# Altium schematic sheet FanControl.SchDoc
size A; DocumentNumber: 3; SheetNumber: 3; SheetTotal: 4
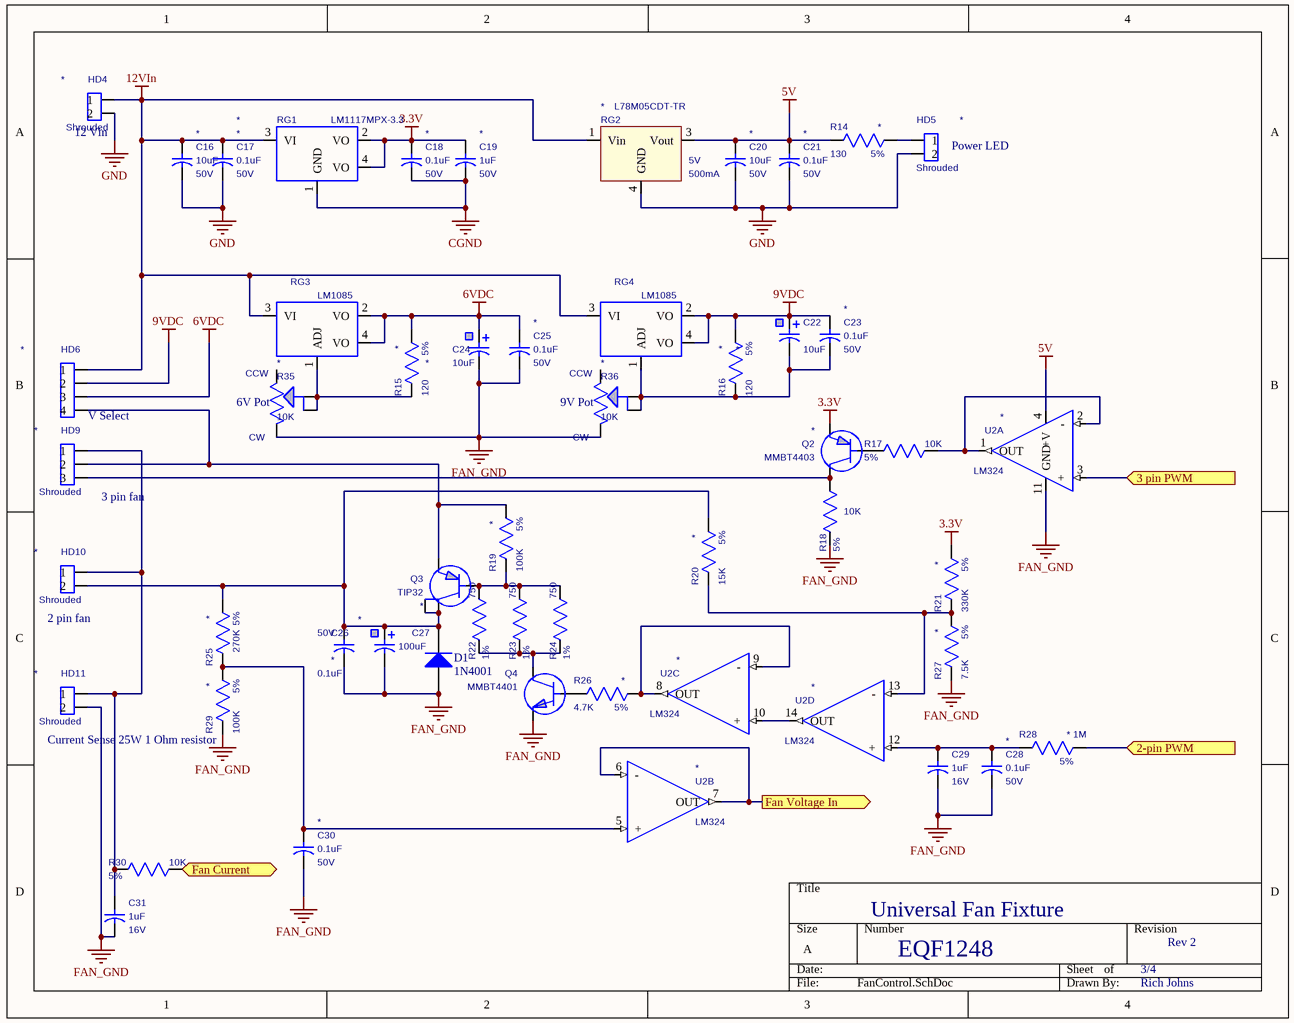
[diagram p0: FanControl.SchDoc]

## Parts
C16  value 10uF  Voltage: 50V  [1206]  (hidden comment: CAP_NON_POLAR_SMT)
C17  value 0.1uF  Voltage: 50V  [0603]  (hidden comment: CAP_NON_POLAR_SMT)
C18  value 0.1uF  Voltage: 50V  [0603]  (hidden comment: CAP_NON_POLAR_SMT)
C19  value 1uF  Voltage: 50V  [1812]  (hidden comment: CAP_NON_POLAR_SMT)
C20  value 10uF  Voltage: 50V  [1206]  (hidden comment: CAP_NON_POLAR_SMT)
C21  value 0.1uF  Voltage: 50V  [0603]  (hidden comment: CAP_NON_POLAR_SMT)
C22  value 10uF  [EIA3216-18]  (hidden comment: 10UF_TANT_16V)
C23  value 0.1uF  Voltage: 50V  [0603]  (hidden comment: CAP_NON_POLAR_SMT)
C24  value 10uF  [EIA3216-18]  (hidden comment: 10UF_TANT_16V)
C25  value 0.1uF  Voltage: 50V  [0603]  (hidden comment: CAP_NON_POLAR_SMT)
C26  value 100uF  [CAP_100RP42]  (hidden comment: 100UF_RP_35V_100)
C27  value 0.1uF  Voltage: 50V  [0603]  (hidden comment: CAP_NON_POLAR_SMT)
C28  value 0.1uF  Voltage: 50V  [0603]  (hidden comment: CAP_NON_POLAR_SMT)
C29  value 1uF  Voltage: 16V  [0603]  (hidden comment: 1.0uF_0603_16V)
C30  value 0.1uF  Voltage: 50V  [0603]  (hidden comment: CAP_NON_POLAR_SMT)
C31  value 1uF  Voltage: 16V  [0603]  (hidden comment: 1.0uF_0603_16V)
D1  1N4001  [DSO-C2/X3.3]
HD4  HeaderType: Shrouded  [HDR2PIN100SHRD]  (hidden comment: HDR2PIN100SHRD)
HD5  HeaderType: Shrouded  [HDR2PIN100SHRD]  (hidden comment: HDR2PIN100SHRD)
HD6  HDR4PIN100SHRD  [HDR4PIN100SHRD]  (value not drawn)
HD9  HeaderType: Shrouded  [HDR3PIN100SHRD]  (hidden comment: HDR3PIN100SHRD)
HD10  HeaderType: Shrouded  [HDR2PIN100SHRD]  (hidden comment: HDR2PIN100SHRD)
HD11  HeaderType: Shrouded  [HDR2PIN100SHRD]  (hidden comment: HDR2PIN100SHRD)
Q2  value MMBT4403  [SOT23-3]  (hidden comment: PNP_TRANSISTOR)
Q3  TIP32  [TO-220-NORMAL]
Q4  value MMBT4401  [SOT23-3]  (hidden comment: 2N4401_SOT23)
R14  value 130  Tolerance: 5%  [RC0603REFLOW-IPC]  (hidden comment: R0603REFLOW_5%)
R15  value 120  Tolerance: 5%  [RC0603REFLOW-IPC]  (hidden comment: R0603REFLOW_5%)
R16  value 120  Tolerance: 5%  [RC0603REFLOW-IPC]  (hidden comment: R0603REFLOW_5%)
R17  value 10K  Tolerance: 5%  [0603]  (hidden comment: Resistor_0603_5%)
R18  value 10K  Tolerance: 5%  [0603]  (hidden comment: Resistor_0603_5%)
R19  value 100K  Tolerance: 5%  [RC0603REFLOW-IPC]  (hidden comment: R0603REFLOW_5%)
R20  value 15K  Tolerance: 5%  [RC0603REFLOW-IPC]  (hidden comment: R0603REFLOW_5%)
R21  value 330K  Tolerance: 5%  [RC0603REFLOW-IPC]  (hidden comment: R0603REFLOW_5%)
R22  value 750  Tolerance: 1%  [0603]  (hidden comment: Resistor_0603_1%)
R23  value 750  Tolerance: 1%  [0603]  (hidden comment: Resistor_0603_1%)
R24  value 750  Tolerance: 1%  [0603]  (hidden comment: Resistor_0603_1%)
R25  value 270K  Tolerance: 5%  [RC0603REFLOW-IPC]  (hidden comment: R0603REFLOW_5%)
R26  value 4.7K  Tolerance: 5%  [RC0603REFLOW-IPC]  (hidden comment: R0603REFLOW_5%)
R27  value 7.5K  Tolerance: 5%  [RC0603REFLOW-IPC]  (hidden comment: R0603REFLOW_5%)
R28  value 1M  Tolerance: 5%  [RC0603REFLOW-IPC]  (hidden comment: R0603REFLOW_5%)
R29  value 100K  Tolerance: 5%  [RC0603REFLOW-IPC]  (hidden comment: R0603REFLOW_5%)
R30  value 10K  Tolerance: 5%  [0603]  (hidden comment: Resistor_0603_5%)
R35  value 10K  [6MM POT]  (hidden comment: POT 6MM 10K)
R36  value 10K  [6MM POT]  (hidden comment: POT 6MM 10K)
RG1  value LM1117MPX-3.3  [SOT-223]  (hidden comment: LM1117SPX-3.3_SOT223)
RG2  value L78M05CDT-TR  Voltage: 5V  Amperage: 500mA  [DPAK]  (hidden comment: REGULATOR_DPAK)
RG3  value LM1085  [TO-220-NORMAL]  (hidden comment: LM1085_TO220)
RG4  value LM1085  [TO-220-NORMAL]  (hidden comment: LM1085_TO220)
U2  value LM324  [SOIC14REFLOW-IPC]  (hidden comment: LM324_SOIC14)  (parts A,B,C,D of 4)

## Ports
2-pin PWM (in), 3 pin PWM (in), Fan Current (out), Fan Voltage In (out)

## Nets
3.3V: C18.1(pin1) C19.1(pin1) Q2.2(emitter) R21.1(pin1) RG1.2(VO) RG1.4(VO)
5V: C20.1(pin1) C21.1(pin1) R14.2(pin2) RG2.3(Vout) U2.4(+V)
6VDC: C24.1(+) C25.1(pin1) HD6.3 R15.1(pin1) RG3.2(VO) RG3.4(VO)
9VDC: C22.1(+) C23.1(pin1) HD6.2 R16.1(pin1) RG4.2(VO) RG4.4(VO)
12VIn: C16.1(pin1) C17.1(pin1) HD4.1 HD6.1 RG1.3(VI) RG2.1(Vin) RG3.3(VI) RG4.3(VI)
CGND: C18.2(pin2) C19.2(pin2) RG1.1(GND)
FAN_GND: C24.2(-) C25.2(pin2) C26.2(pin2) C27.2(pin2) C28.2(pin2) C29.2(pin2) C30.2(pin2) C31.2(pin2) D1.1(A) HD11.2 Q4.2(emitter) R18.2(pin2) R27.2(pin2) R29.2(pin2) R35.4 R36.4 U2.11(GND)
GND: C16.2(pin2) C17.2(pin2) C20.2(pin2) C21.2(pin2) HD4.2 HD5.2 RG2.4(GND)
2-pin PWM: R28.1(pin1) ; port 2-pin PWM
3 pin PWM: U2.3(+) ; port 3 pin PWM
Fan Current: R30.1(pin1) ; port Fan Current
Fan Voltage In: U2.6(-) U2.7(OUT) ; port Fan Voltage In
NetC22_2: C22.2(-) C23.2(pin2) R16.2(pin2) R36.2 R36.3 RG4.1(ADJ)
NetC26_1: C26.1(pin1) C27.1(pin1) D1.2(K) HD10.2 Q3.2(C) Q3.4(C) R20.1(pin1) R25.1(pin1)
NetC28_1: C28.1(pin1) C29.1(pin1) R28.2(pin2) U2.12(+)
NetC30_1: C30.1(pin1) R25.2(pin2) R29.1(pin1) U2.5(+)
NetC31_1: C31.1(pin1) HD9.1 HD10.1 HD11.1 R30.2(pin2)
NetHD5_1: HD5.1 R14.1(pin1)
NetHD6_4: HD6.4 HD9.2 Q3.3(E) R19.1(pin1)
NetHD9_3: HD9.3 Q2.3(collector) R18.1(pin1)
NetQ2_1: Q2.1(base) R17.2(pin2)
NetQ3_1: Q3.1(B) R19.2(pin2) R22.1(pin1) R23.1(pin1) R24.1(pin1)
NetQ4_1: Q4.1(base) R26.2(pin2)
NetQ4_3: Q4.3(collector) R22.2(pin2) R23.2(pin2) R24.2(pin2)
NetR15_2: R15.2(pin2) R35.2 R35.3 RG3.1(ADJ)
NetR17_1: R17.1(pin1) U2.1(OUT) U2.2(-)
NetR20_2: R20.2(pin2) R21.2(pin2) R27.1(pin1) U2.13(-)
NetR26_1: R26.1(pin1) U2.8(OUT) U2.9(-)
NetU2_10: U2.10(+) U2.14(OUT)

Not connected (* = marked no-connect by the designer): HD4 3; HD5 3; HD6 5; HD9 4; HD10 3; HD11 3; R35 1; R36 1; RG2 2(GND)

## Notes on the sheet
- (near HD4) 12 Vin
- (near HD5) Power LED
- (near HD6) V Select
- (near R35) 6V Pot
- (near R36) 9V Pot
- (near HD9) 3 pin fan
- (near HD10) 2 pin fan
- (near R29) Current Sense 25W 1 Ohm resistor
- Universal Fan Fixture
- EQF1248
- 3/4
- Rev 2
- Rich Johns
- (in symbol 6440) CCW; CW

## Library data of the parts
C16 C20 = 265299: Capacitor, 10uF, 50V, Ceramic, X5R, +/- 20%, Non-Polar, 1206, Taiyo Yuden: UMK316BBJ106ML-T or equivalent; plIDX: 265299; Tolerance: +/- 20%; CheckedBy: Sam Rhoufiry; DNS: *; ComponentType: Capacitor; CreatedBy: Mike Tyger; LastUpdatedBy: Mike Tyger; Cost: 0.05; Composition: Ceramic; CapType: X5R; Polarity: Non-Polar; Package: 1206; Vendor: Taiyo Yuden: UMK316BBJ106ML-T or equivalent; ComponentLink1URL: http://www.yuden.co.jp/productdata/catalog/en/mlcc01_e.pdf; ComponentLink1Description: Datasheet; ComponentLink4URL: https://pdm.iconfitness.com/PDM/EBOM/PartsMaintenance/PartsMaintenance.aspx?Editplidx=265299; ComponentLink4Description: PDM Parts Maintenance
C17 C18 C21 C23 C25 C27 C28 C30 = 264790: Capacitor, 0.1uF, 50V, Ceramic, X7R, +/- 20%, Non-Polar, 0603, Kemet: C0603C104M5RACTU or equivalent; plIDX: 264790; Tolerance: +/- 20%; CheckedBy: Sam Rhoufiry; DNS: *; ComponentType: Capacitor; CreatedBy: Mike Tyger; LastUpdatedBy: Mike Tyger; Cost: 0.01; Composition: Ceramic; CapType: X7R; Polarity: Non-Polar; Package: 0603; Vendor: Kemet: C0603C104M5RACTU or equivalent; ComponentLink4URL: https://pdm.iconfitness.com/PDM/EBOM/PartsMaintenance/PartsMaintenance.aspx?Editplidx=264790; ComponentLink4Description: PDM Parts Maintenance
C19 = 265012: Capacitor, 1uF, 50V, Ceramic, Z5U, +/- 20%, Non-Polar, 1812, Kemet: C1812C105M5UACTU or equivalent; plIDX: 265012; Tolerance: +/- 20%; CheckedBy: Sam Rhoufiry; DNS: *; ComponentType: Capacitor; CreatedBy: Mike Tyger; LastUpdatedBy: Mike Tyger; Cost: 0; Composition: Ceramic; CapType: Z5U; Polarity: Non-Polar; Package: 1812; Vendor: Kemet: C1812C105M5UACTU or equivalent; ComponentLink4URL: https://pdm.iconfitness.com/PDM/EBOM/PartsMaintenance/PartsMaintenance.aspx?Editplidx=265012; ComponentLink4Description: PDM Parts Maintenance
C22 C24 = 10669: Capacitor, 10uF, 16V, Tantalum, General Purpose, +/- 20%, Polar, EIA 3216-18, KEMET: T491A106M016AS or Exact Equivalent; Tolerance: +/- 20%; plIDX: 10669; Voltage: 16V; Composition: Tantalum; Package: EIA 3216-18; CapType: General Purpose; Polarity: Polar; Vendor: KEMET: T491A106M016AS or Exact Equivalent; CheckedBy: B. Lyon; Datasheet: G:\accel_lib\datasheets\T491-Kemet.pdf; ModifyDate: 01/05/2007 12:29:47; HelpURL: G:\accel_lib\datasheets\T491-Kemet.pdf; ComponentType: Capacitor; DNS: *; Cost: 0.051; ComponentLink4URL: https://pdm.iconfitness.com/PDM/EBOM/PartsMaintenance/PartsMaintenance.aspx?Editplidx=10669; ComponentLink4Description: PDM Parts Maintenance
C26 = 3428: Capacitor, 100uF, 35V, Electrolytic, +/- 20%, Radial, Polar, 0.1 in., Nichicon: UVR1V101MED or Equivalent; LeadSpacing: 0.1 in.; Tolerance: +/- 20%; PackageOutlineLayer: PackageOutline; IDF_COMP: 1; plIDX: 3428; DNS: *; Voltage: 35V; Composition: Electrolytic; Leads: Radial; Polarity: Polar; Vendor: Nichicon: UVR1V101MED or Equivalent; CheckedBy: A. Tyger; ModifyDate: 04/06/2006 14:59:49; Datasheet: G:\accel_lib\datasheets\Nichicon-VRSerisAlumElecRadialCap.pdf; ComponentHeight: 475mil; HelpURL: G:\accel_lib\datasheets\Nichicon-VRSerisAlumElecRadialCap.pdf; ComponentType: Capacitor; Cost: 0.05; ComponentLink4URL: https://pdm.iconfitness.com/PDM/EBOM/PartsMaintenance/PartsMaintenance.aspx?Editplidx=3428; ComponentLink4Description: PDM Parts Maintenance
C29 C31 = 18838: Capacitor, 1uF, 16V, Ceramic, X5R, +/- 10%, Non-Polar, 0603, 2, MURATA: GRM188R61C105KA93D OR EQUIVALENT; Tolerance: +/- 10%; plIDX: 18838; Composition: Ceramic; Package: 0603; CapType: X5R; Polarity: Non-Polar; Vendor: MURATA: GRM188R61C105KA93D OR EQUIVALENT; CheckedBy: gdeguzman; ModifyDate: 3/9/10; ComponentType: Capacitor; Supplier 1: Digi-Key; Supplier Part Number 1: 490-1536-2-ND; LastUpdatedBy: Rui Zhang; Cost: 0.001; Pins: 2; ComponentLink4URL: https://pdm.iconfitness.com/PDM/EBOM/PartsMaintenance/PartsMaintenance.aspx?Editplidx=18838; ComponentLink4Description: PDM Parts Maintenance
D1 = Diode: Default Diode; Published: 8-Jun-2000; LatestRevisionDate: 17-Jul-2002; LatestRevisionNote: Re-released for DXP Platform.; PackageVersion: Sep-1996; PackageReference: SMC; Publisher: Altium Limited; Code_JEDEC: DO-214-AB
HD4 HD5 HD10 HD11 = 1766: Header, 0.100 in., 2 Pins, Shrouded, AMP: 644486-2; PackageOutlineLayer: PackageOutline; IDF_COMP: 1; plIDX: 1766; LeadSpacing: 0.100 in.; Pins: 2; Vendor: AMP: 644486-2; CheckedBy: *; Datasheet: g:\accel_lib\datasheets\MTA-AMP.pdf; ModifyDate: 07/30/2008 17:40:27; ComponentHeight: 625mil; ComponentType: Header; DNS: *; LastUpdatedBy: Mike Tyger; Cost: 0.042; ComponentLink4URL: https://pdm.iconfitness.com/PDM/EBOM/PartsMaintenance/PartsMaintenance.aspx?Editplidx=1766; ComponentLink4Description: PDM Parts Maintenance
HD6 = 1768: Header, 0.100 in., 4 pin Pins, Shrouded, AMP: 644486-4; IDF_COMP: 1; Reference: g:\accel_lib\datasheets\MTA-AMP.pdf; plIDX: 1768; LeadSpacing: 0.100 in.; Pins: 4 pin; HeaderType: Shrouded; Vendor: AMP: 644486-4; CheckedBy: Michael Angeli; Datasheet: G:\accel_lib\datasheets\644486-AMP-header.pdf; ComponentHeight: 625mil; ModifyDate: 07/30/2008 17:40:28; ComponentType: Header; DNS: *; Cost: 0.07; ComponentLink4URL: https://pdm.iconfitness.com/PDM/EBOM/PartsMaintenance/PartsMaintenance.aspx?Editplidx=1768; ComponentLink4Description: PDM Parts Maintenance
HD9 = 1767: Header, 0.100 in., 3 pin Pins, Shrouded, AMP: 644486-3; PackageOutlineLayer: PackageOutline; IDF_COMP: 1; plIDX: 1767; LeadSpacing: 0.100 in.; Pins: 3 pin; Vendor: AMP: 644486-3; CheckedBy: Grunt Mcfunkwhistle; Datasheet: g:\accel_lib\datasheets\MTA-AMP.pdf; ModifyDate: 10/23/2008 15:32:40; ComponentHeight: 625mil; ComponentType: Header; DNS: *; Cost: 0.055; ComponentLink4URL: https://pdm.iconfitness.com/PDM/EBOM/PartsMaintenance/PartsMaintenance.aspx?Editplidx=1767; ComponentLink4Description: PDM Parts Maintenance
Q2 = 18850: Transistor, MMBT4403, 40V, SOT23-3, PNP, Transistor, On Semi: MMBT4403LT1; plIDX: 18850; CheckedBy: gdeguzman; DNS: *; ComponentType: Transistor; LastUpdatedBy: Mike Tyger; Cost: 0.0124; Voltage: 40V; Package: SOT23-3; TransistorType: PNP; ChipType: Transistor; Vendor: On Semi: MMBT4403LT1; ComponentLink4URL: https://pdm.iconfitness.com/PDM/EBOM/PartsMaintenance/PartsMaintenance.aspx?Editplidx=18850; ComponentLink4Description: PDM Parts Maintenance
Q3 = 2637: Transistor, TIP32, 40V, TO-220, 3A, PNP, Any; plIDX: 2637; Voltage: 40V; Package: TO-220; Amperage: 3A; TransistorType: PNP; CheckedBy: B. Lyon; Datasheet: g:\accel_lib\datasheets\TIP32-Fairchild.pdf; Vendor: Any; ModifyDate: 08/27/2007 16:01:42; HelpURL: g:\accel_lib\datasheets\TIP32-Fairchild.pdf; ComponentType: Transistor; DNS: *; Value: TIP32; Cost: 0.125; ComponentLink4URL: https://pdm.iconfitness.com/PDM/EBOM/PartsMaintenance/PartsMaintenance.aspx?Editplidx=2637; ComponentLink4Description: PDM Parts Maintenance
Q4 = 18848: Transistor, MMBT4401, 40V, SOT23, 500mA, 3, NPN, Transistor, On Semi: MMBT4401LT1; plIDX: 18848; Package: SOT23; Voltage: 40V; Amperage: 500mA; TransistorType: NPN; Vendor: On Semi: MMBT4401LT1; CheckedBy: gdeguzman; ModifyDate: 3/9/10; ChipType: Transistor; ComponentType: Transistor; Supplier 1: Digi-Key; Supplier Part Number 1: MMBT4401-FDITR-ND; LastUpdatedBy: Mike Tyger; Cost: 0.0124; Pins: 3; ComponentLink4URL: https://pdm.iconfitness.com/PDM/EBOM/PartsMaintenance/PartsMaintenance.aspx?Editplidx=18848; ComponentLink4Description: PDM Parts Maintenance
R14 = 2403: Resistor, 130, ThickFilm, 5%, 0603, 1/10W, Any; Notes: .; plIDX: 2403; Wattage: 1/10W; Composition: ThickFilm; Package: 0603; Vendor: Any; CheckedBy: Michael Angeli; ModifyDate: 03/02/2004 17:13:13; ComponentType: Resistor; DNS: *; Cost: 0.001; ComponentLink4URL: https://pdm.iconfitness.com/PDM/EBOM/PartsMaintenance/PartsMaintenance.aspx?Editplidx=2403; ComponentLink4Description: PDM Parts Maintenance
R15 R16 = 5495: Resistor, 120, ThickFilm, 5%, 0603, 1/10W, Any; Notes: .; plIDX: 5495; Wattage: 1/10W; Composition: ThickFilm; Package: 0603; Vendor: Any; CheckedBy: Michael Angeli; ModifyDate: 03/02/2004 17:13:13; ComponentType: Resistor; DNS: *; Cost: 0.001; ComponentLink4URL: https://pdm.iconfitness.com/PDM/EBOM/PartsMaintenance/PartsMaintenance.aspx?Editplidx=5495; ComponentLink4Description: PDM Parts Maintenance
R17 R18 R30 = 18857: Resistor, 10K, ThickFilm, 5%, 0603, 1/10W, 2, Any; plIDX: 18857; Wattage: 1/10W; Composition: ThickFilm; Package: 0603; Vendor: Any; CheckedBy: Joe Diffie; ModifyDate: 3/9/10; ComponentType: Resistor; LastUpdatedBy: Rui Zhang; Cost: 0.0004; Pins: 2; ComponentLink4URL: https://pdm.iconfitness.com/PDM/EBOM/PartsMaintenance/PartsMaintenance.aspx?Editplidx=18857; ComponentLink4Description: PDM Parts Maintenance
R19 R29 = 2046: Resistor, 100K, ThickFilm, 5%, 0603, 1/10W, Any; Notes: .; plIDX: 2046; Wattage: 1/10W; Composition: ThickFilm; Package: 0603; Vendor: Any; CheckedBy: Michael Angeli; ModifyDate: 03/02/2004 17:13:13; ComponentType: Resistor; DNS: *; Cost: 0.001; ComponentLink4URL: https://pdm.iconfitness.com/PDM/EBOM/PartsMaintenance/PartsMaintenance.aspx?Editplidx=2046; ComponentLink4Description: PDM Parts Maintenance
R20 = 2157: Resistor, 15K, ThickFilm, 5%, 0603, 1/10W, Any; Notes: .; plIDX: 2157; Wattage: 1/10W; Composition: ThickFilm; Package: 0603; Vendor: Any; CheckedBy: Michael Angeli; ModifyDate: 03/02/2004 17:13:13; ComponentType: Resistor; DNS: *; Cost: 0.001; ComponentLink4URL: https://pdm.iconfitness.com/PDM/EBOM/PartsMaintenance/PartsMaintenance.aspx?Editplidx=2157; ComponentLink4Description: PDM Parts Maintenance
R21 = 5186: Resistor, 330K, ThickFilm, 5%, 0603, 1/10W, Any; Notes: .; plIDX: 5186; Wattage: 1/10W; Composition: ThickFilm; Package: 0603; Vendor: Any; CheckedBy: Michael Angeli; ModifyDate: 03/02/2004 17:13:13; ComponentType: Resistor; DNS: *; Cost: 0.001; ComponentLink4URL: https://pdm.iconfitness.com/PDM/EBOM/PartsMaintenance/PartsMaintenance.aspx?Editplidx=5186; ComponentLink4Description: PDM Parts Maintenance
R22-R24 = 20273: Resistor, 750, 1%, 0603, 1/10W, 2, Any; plIDX: 20273; Wattage: 1/10W; Package: 0603; Vendor: Any; CheckedBy: gdeguzman; ComponentLink1Description: Datasheet; ComponentLink1URL: \\iconfitness.com\loganfiles\RND Departments\Electronics\accel_lib\Datasheets\1210_1%_resistor.pdf; ComponentType: Resistor; LastUpdatedBy: Ben Hill; Cost: 0.0006; Pins: 2; ComponentLink4URL: https://pdm.iconfitness.com/PDM/EBOM/PartsMaintenance/PartsMaintenance.aspx?Editplidx=20273; ComponentLink4Description: PDM Parts Maintenance
R25 = 14583: Resistor, 270K, ThickFilm, 5%, 0603, 1/10W, Any; Notes: .; plIDX: 14583; Wattage: 1/10W; Composition: ThickFilm; Package: 0603; Vendor: Any; CheckedBy: Michael Angeli; ModifyDate: 03/02/2004 17:13:13; ComponentType: Resistor; DNS: *; Cost: 0.001; ComponentLink4URL: https://pdm.iconfitness.com/PDM/EBOM/PartsMaintenance/PartsMaintenance.aspx?Editplidx=14583; ComponentLink4Description: PDM Parts Maintenance
R26 = 2071: Resistor, 4.7K, ThickFilm, 5%, 0603, 1/10W, Any; Notes: .; plIDX: 2071; Wattage: 1/10W; Composition: ThickFilm; Package: 0603; Vendor: Any; CheckedBy: Michael Angeli; ModifyDate: 03/02/2004 17:13:13; ComponentType: Resistor; DNS: *; Cost: 0.001; ComponentLink4URL: https://pdm.iconfitness.com/PDM/EBOM/PartsMaintenance/PartsMaintenance.aspx?Editplidx=2071; ComponentLink4Description: PDM Parts Maintenance
R27 = 6345: Resistor, 7.5K, ThickFilm, 5%, 0603, 1/10W, Any; Notes: .; plIDX: 6345; Wattage: 1/10W; Composition: ThickFilm; Package: 0603; Vendor: Any; CheckedBy: Michael Angeli; ModifyDate: 03/02/2004 17:13:13; ComponentType: Resistor; DNS: *; Cost: 0.001; ComponentLink4URL: https://pdm.iconfitness.com/PDM/EBOM/PartsMaintenance/PartsMaintenance.aspx?Editplidx=6345; ComponentLink4Description: PDM Parts Maintenance
R28 = 2052: Resistor, 1M, ThickFilm, 5%, 0603, 1/10W, Any; Notes: .; plIDX: 2052; Wattage: 1/10W; Composition: ThickFilm; Package: 0603; Vendor: Any; CheckedBy: Michael Angeli; ModifyDate: 03/02/2004 17:13:13; ComponentType: Resistor; DNS: *; Cost: 0.001; ComponentLink4URL: https://pdm.iconfitness.com/PDM/EBOM/PartsMaintenance/PartsMaintenance.aspx?Editplidx=2052; ComponentLink4Description: PDM Parts Maintenance
R35 R36 = 6440: Resistor, 10K, Carbon, 20%, 0.2 in X 0.1 in or 0.2 in X 0.2 in, 0.1W, Panasonic: EVN-D8AA03B14; plIDX: 6440; Wattage: 0.1W; Tolerance: 20%; LeadSpacing: 0.2 in X 0.1 in or 0.2 in X 0.2 in; Composition: Carbon; Vendor: Panasonic: EVN-D8AA03B14; CheckedBy: B. Lyon; DNS: *; ComponentType: Resistor; Cost: 0.001; ComponentLink4URL: https://pdm.iconfitness.com/PDM/EBOM/PartsMaintenance/PartsMaintenance.aspx?Editplidx=6440; ComponentLink4Description: PDM Parts Maintenance
RG1 = 18870: Regulator, LM1117MPX-3.3, 3.3V, SOT223, 800mA, 4, LDO, National: LM117MPX-3.3; plIDX: 18870; Voltage: 3.3V; Package: SOT223; Amperage: 800mA; RegulatorType: LDO; Vendor: National: LM117MPX-3.3; CheckedBy: gdeguzman; ModifyDate: 3/15/10; ComponentType: Regulator; Supplier 1: Digi-Key; Supplier Part Number 1: LM1117MPX-3.3TR-ND; DNS: *; LastUpdatedBy: Rui Zhang; Cost: 0.2; Pins: 4; ComponentLink4URL: https://pdm.iconfitness.com/PDM/EBOM/PartsMaintenance/PartsMaintenance.aspx?Editplidx=18870; ComponentLink4Description: PDM Parts Maintenance
RG2 = 265303: Regulator, L78M05CDT-TR, 5V, DPAK, 500mA, Linear, ST: L78M05CDT-TR or equivalent; plIDX: 265303; CheckedBy: B. Lyon; DNS: *; ComponentType: Regulator; CreatedBy: Mike Tyger; LastUpdatedBy: Mike Tyger; Cost: 0.05; Package: DPAK; RegulatorType: Linear; Vendor: ST: L78M05CDT-TR or equivalent; ComponentLink4URL: https://pdm.iconfitness.com/PDM/EBOM/PartsMaintenance/PartsMaintenance.aspx?Editplidx=265303; ComponentLink4Description: PDM Parts Maintenance
RG3 RG4 = 283929: Regulator, LM1085, Adjustable, TO-220, 3A, LDO, Texas Instruments; plIDX: 283929; ComponentType: Regulator; CreatedBy: Rui Zhang; LastUpdatedBy: Rui Zhang; Cost: 0; Voltage: Adjustable; Package: TO-220; Amperage: 3A; RegulatorType: LDO; Vendor: Texas Instruments; ComponentLink4URL: https://pdm.iconfitness.com/PDM/EBOM/PartsMaintenance/PartsMaintenance.aspx?Editplidx=283929; ComponentLink4Description: PDM Parts Maintenance
U2 = 1795: IC, LM324, SOIC, 14 pin, Op-Amp, National Semiconductor; IDF_COMP: 1; PackageOutlineLayer: PackageOutline; plIDX: 1795; Package: SOIC; Pins: 14 pin; ChipType: Op-Amp; Datasheet: g:\accel_lib\datasheets\LM324-national.pdf; CheckedBy: B. Lyon; ComponentHeight: 70mil; ModifyDate: 05/19/2006 16:03:59; HelpURL: g:\accel_lib\datasheets\LM324-national.pdf; ComponentType: IC; DNS: *; Cost: 0.0602; Vendor: National Semiconductor; ComponentLink4URL: https://pdm.iconfitness.com/PDM/EBOM/PartsMaintenance/PartsMaintenance.aspx?Editplidx=1795; ComponentLink4Description: PDM Parts Maintenance